# Altium schematic sheet TEENSY 1.1.SchDoc
size A; SheetNumber: 1; SheetTotal: 1
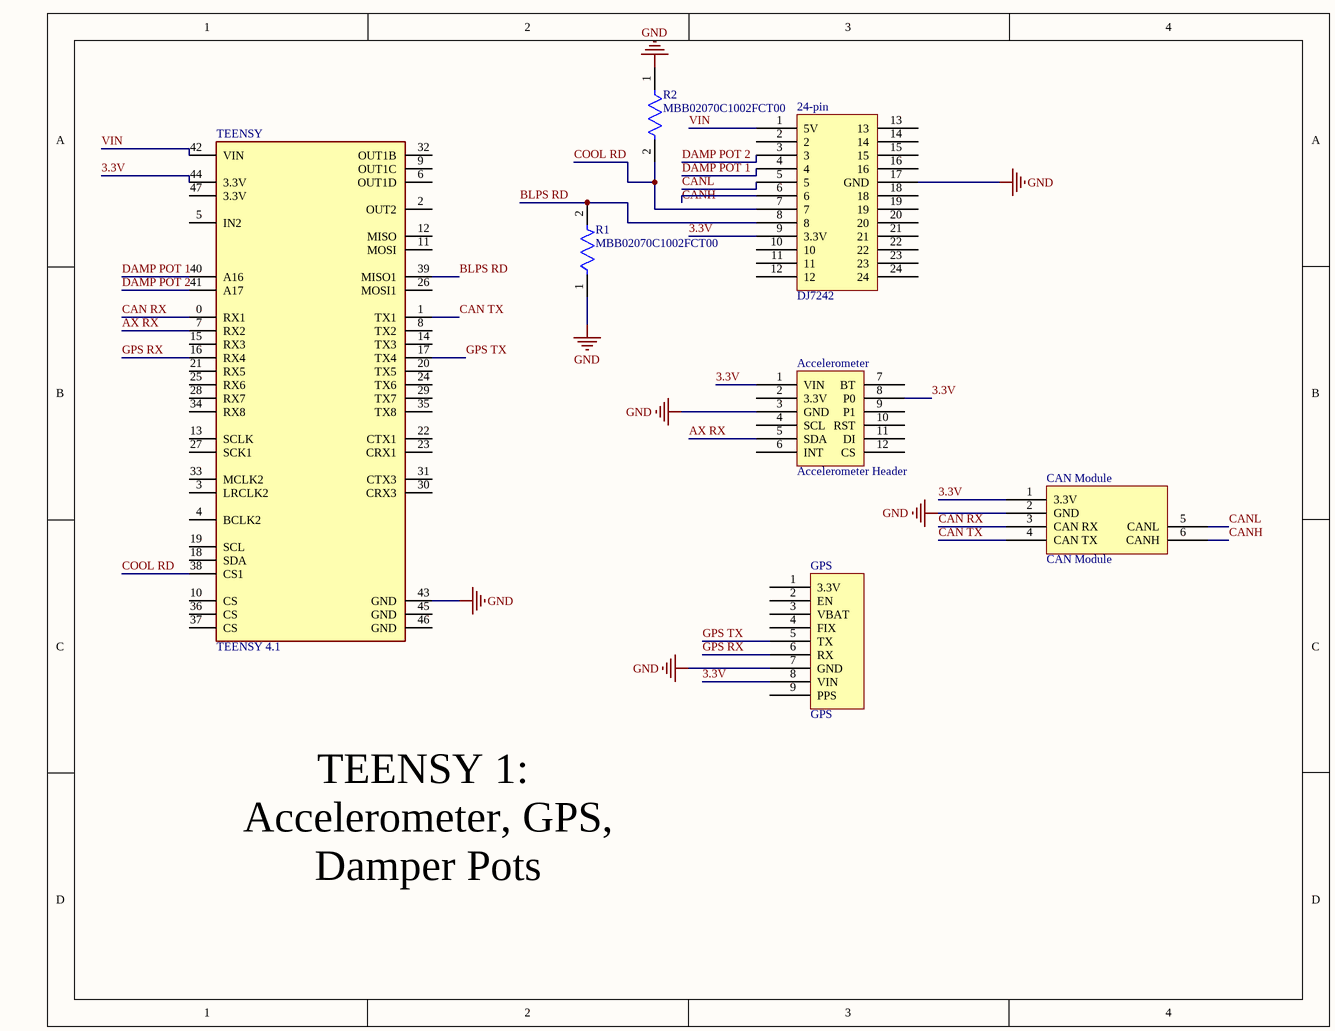
[diagram p0: TEENSY 1.1.SchDoc]

## Parts
24-pin  DJ7242  [DJ7242-Footprint-1]
Accelerometer  Accelerometer Header  [Accelerometer Header-Footprint-1]
CAN_Module  CAN Module  [CAN Module-Footprint-1]
GPS  GPS  [GPS-Footprint-1]
R1  MBB02070C1002FCT00  [FP-MBB0207-MFG]
R2  MBB02070C1002FCT00  [FP-MBB0207-MFG]
TEENSY  TEENSY 4.1  [FP-DEV-16996-MFG]

## Nets
GND: 24-pin.17(GND) Accelerometer.3(GND) CAN_Module.2(GND) GPS.7(GND) R1.1 R2.1 TEENSY.43(GND)
3.3V: 24-pin.9(3.3V) Accelerometer.1(VIN) Accelerometer.8(P0) CAN_Module.1(3.3V) GPS.8(VIN) TEENSY.44(3.3V)
AX RX: Accelerometer.5(SDA) TEENSY.7(RX2)
BLPS RD: 24-pin.8 R1.2 TEENSY.39(MISO1)
CAN RX: CAN_Module.3(CAN_RX) TEENSY.0(RX1)
CAN TX: CAN_Module.4(CAN_TX) TEENSY.1(TX1)
CANH: 24-pin.6 CAN_Module.6(CANH)
CANL: 24-pin.5 CAN_Module.5(CANL)
COOL RD: 24-pin.7 R2.2 TEENSY.38(CS1)
DAMP POT 1: 24-pin.4 TEENSY.40(A16)
DAMP POT 2: 24-pin.3 TEENSY.41(A17)
GPS RX: GPS.6(RX) TEENSY.16(RX4)
GPS TX: GPS.5(TX) TEENSY.17(TX4)
VIN: 24-pin.1(5V) TEENSY.42(VIN)

Not connected (* = marked no-connect by the designer): 24-pin 2 10 11 12 13 14 15 16 18 19 20 21 22 23 24; Accelerometer 2(3.3V) 4(SCL) 6(INT) 7(BT) 9(P1) 10(RST) 11(DI) 12(CS); GPS 1(3.3V) 2(EN) 3(VBAT) 4(FIX) 9(PPS); TEENSY 2(OUT2) 3(LRCLK2) 4(BCLK2) 5(IN2) 6(OUT1D) 8(TX2) 9(OUT1C) 10(CS) 11(MOSI) 12(MISO) 13(SCLK) 14(TX3) 15(RX3) 18(SDA) 19(SCL) 20(TX5) 21(RX5) 22(CTX1) 23(CRX1) 24(TX6) 25(RX6) 26(MOSI1) 27(SCK1) 28(RX7) 29(TX7) 30(CRX3) 31(CTX3) 32(OUT1B) 33(MCLK2) 34(RX8) 35(TX8) 36(CS) 37(CS) 45(GND) 46(GND) 47(3.3V)

## Notes on the sheet
- TEENSY 1:
  Accelerometer, GPS, Damper Pots

## Library data of the parts
24-pin = CMP-00030-00002-4: 24-pin connector
Accelerometer = CMP-002-00071-3: Header for Adafruit Accelerometer
CAN_Module = CMP-00030-00003-1: CAN waveshare
GPS = CMP-002-00072-2: Adafruit GPS chip
R1 R2 = CMP-02408-000035-1: RES 10K OHM 0.6W 1% AXIAL; Voltage Rating: 300V; Resistance: 10kR; Max Power Dissipation: 600mW; Temperature Coefficient: 50ppm/°C; Radiation Hardening: No; Case/Package: Conformal; Termination: Axial; Military Standard: Not; Length: 6.5mm; Voltage Rating (DC): 300V; RoHS Compliant: Yes; Number of Terminations: 2; Packaging: Tape and Reel; Features: Automotive AEC-Q200; Tolerance: 1%; Min Operating Temperature: -55°C; Power Rating: 600mW; Lead Free: Lead Free; Resistor Type: Metal Film; Construction: Cylindrical; Series: MBB 0207 - Professional; Max Operating Temperature: 155°C; Diameter: 2.5mm; Resistance Tolerance: 1%; Contact Plating: Tin; Technology: THIN FILM
TEENSY = CMP-157412-000001-1: TEENSY 4.1 (HEADERS)